# EasyEDA Pro project brainmodule1.epro, schematic Schematic
Board Name: HV No Display; Create Date: 2025-05-05; Page Name: P1; Project Name: HV No Display; Schematic Name: Schematic; Update Date: 2025-05-05; Company: Halo Vision; Drawn: Kahu Hutton; Page Size: A4; Part Number: 001; Reviewed: Kahu Hutton; Version: V0.6
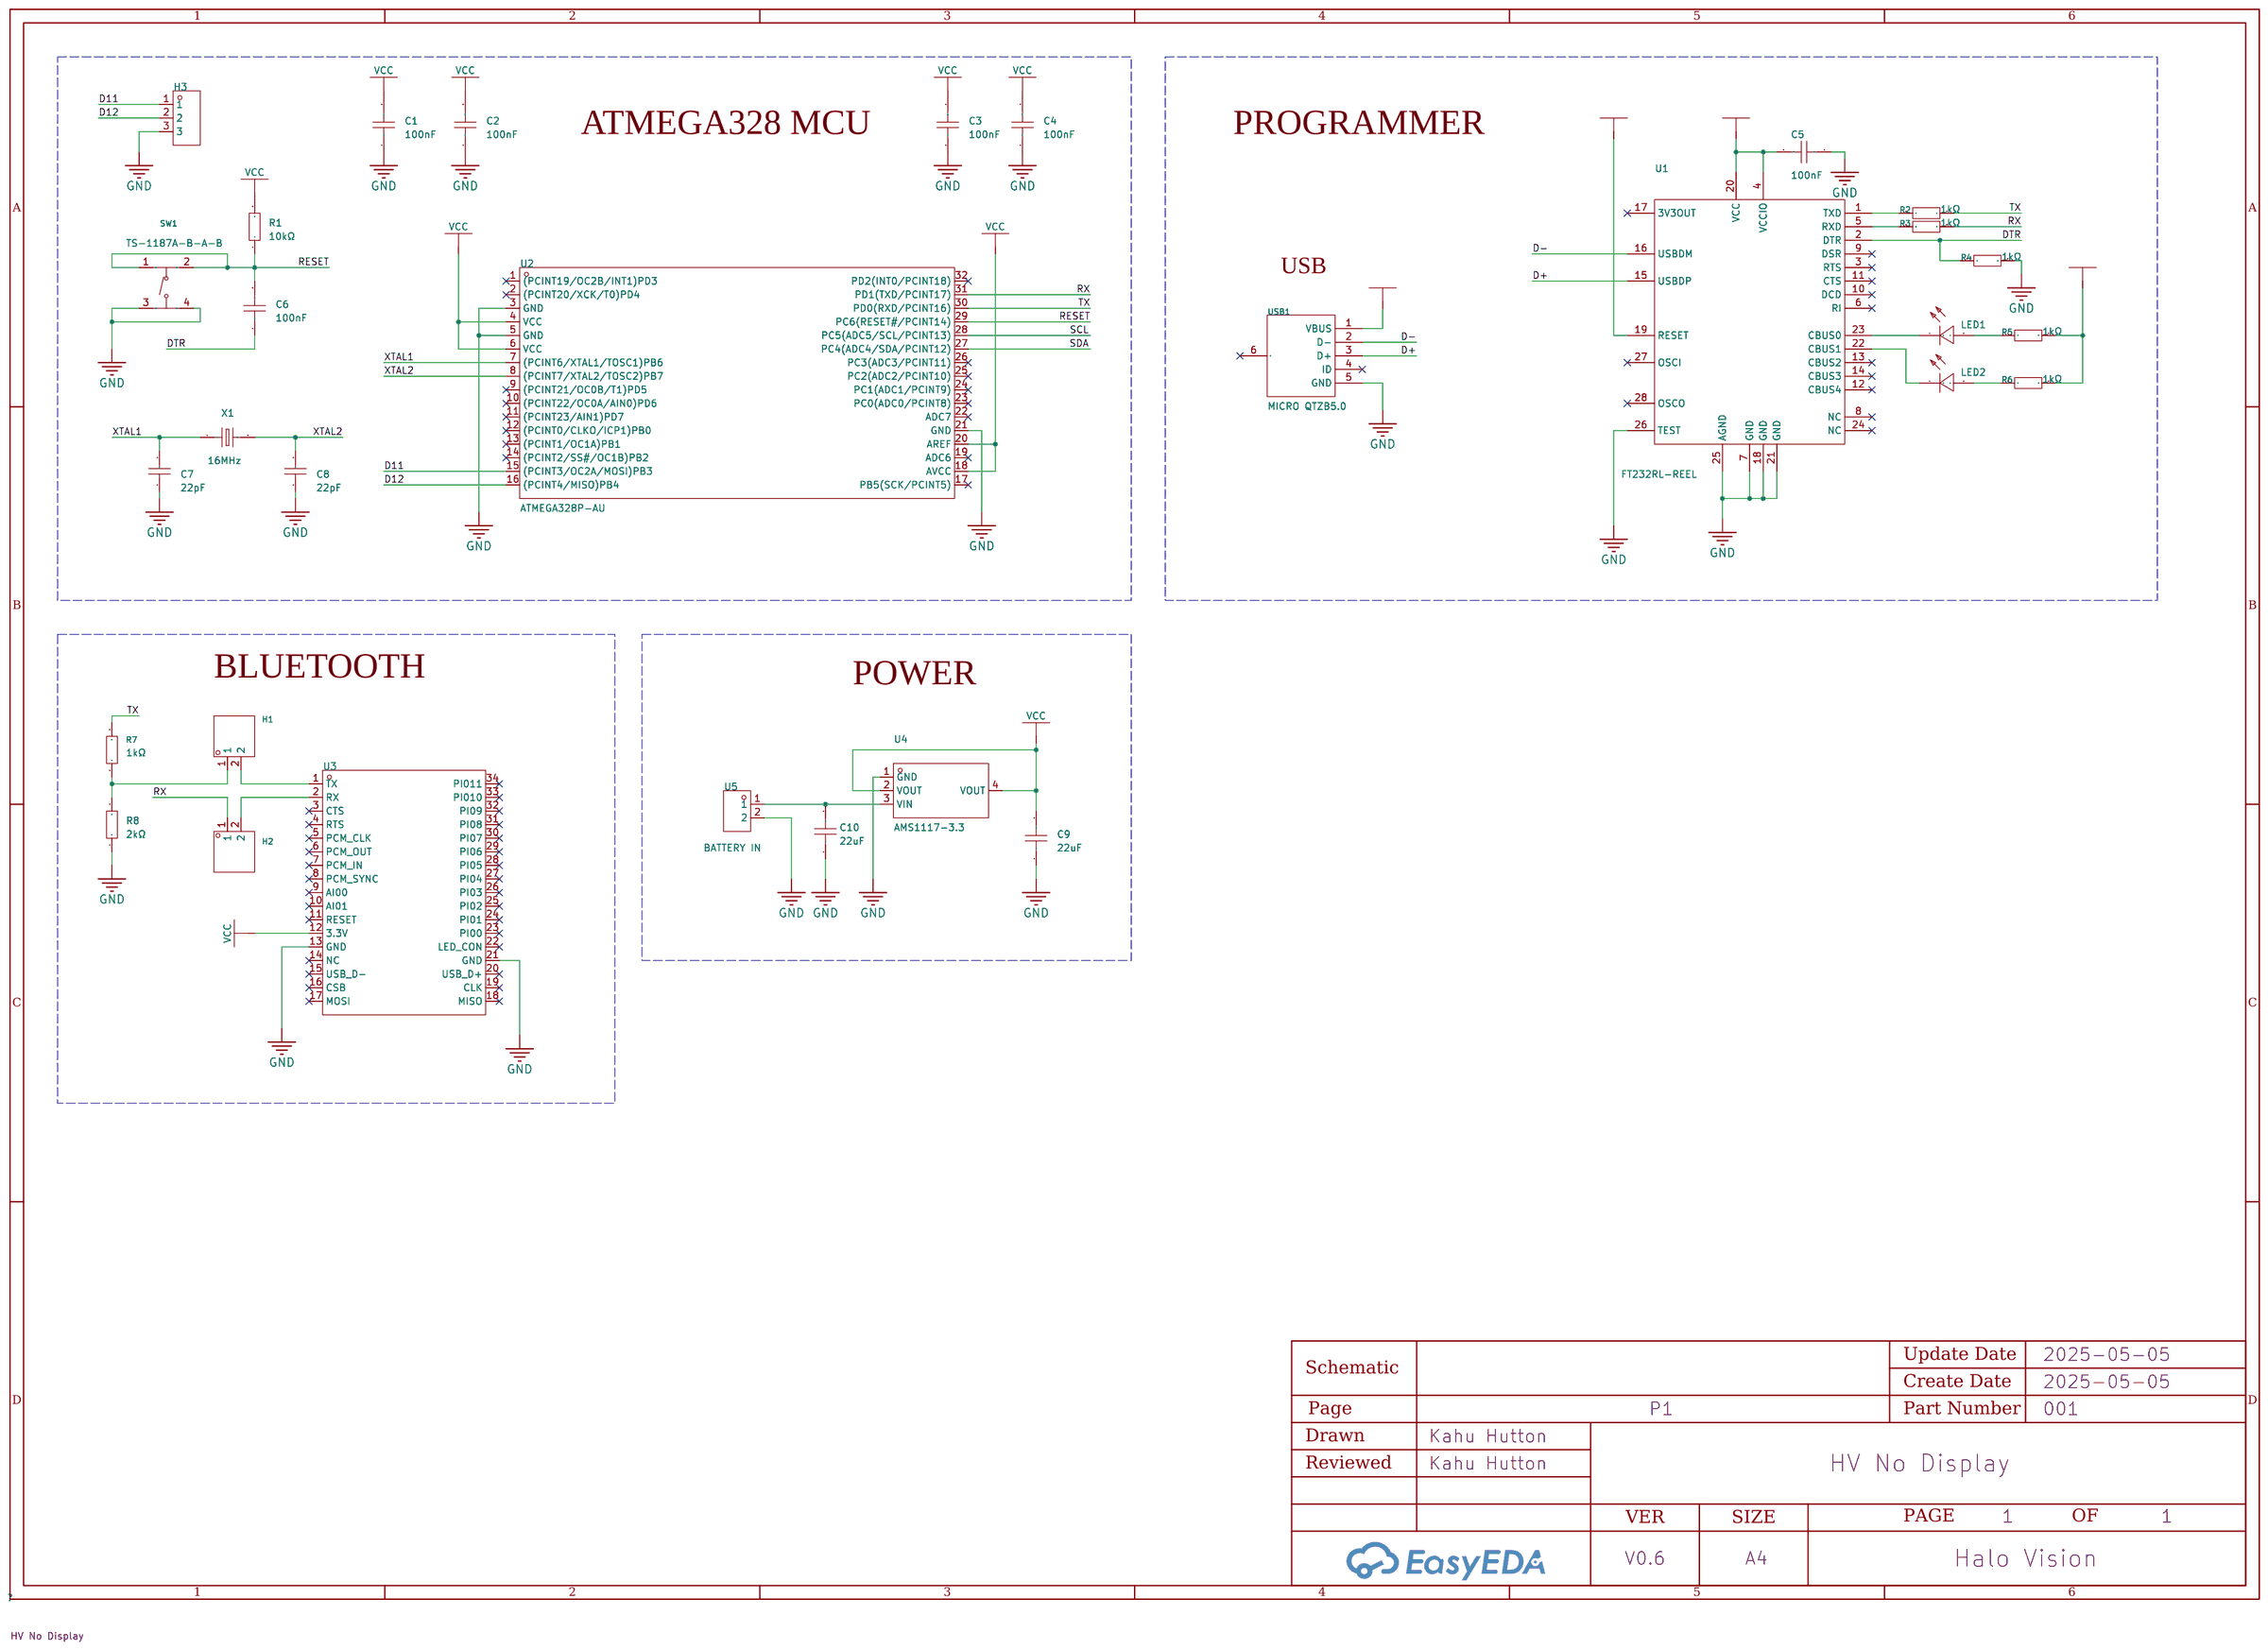
[diagram p0: schematic sheet]

## Parts
C1  100nF  [C0402]
C2  100nF  [C0402]
C3  100nF  [C0402]
C4  100nF  [C0402]
C5  100nF  [C0402]
C6  100nF  [C0402]
C7  22pF  [C0402]
C8  22pF  [C0402]
C9  22uF  [C0805]
C10  22uF  [C0805]
H1  -  [HDR-TH_2P-P2.54-V-M-1]
H2  -  [HDR-TH_2P-P2.54-V-M-1]
H3  -  [HDR-TH_3P-P2.54-V-M]
LED1  TJ-S1005SW4TGLC2R-A5  [LED0402-RD]
LED2  TJ-S1005SW4TGLC2R-A5  [LED0402-RD]
R1  10kΩ  [R0402]
R2  1kΩ  [R0402]
R3  1kΩ  [R0402]
R4  1kΩ  [R0402]
R5  1kΩ  [R0402]
R6  1kΩ  [R0402]
R7  1kΩ  [R0402]
R8  2kΩ  [R0402]
SW1  TS-1187A-B-A-B  [SW-SMD_4P-L5.1-W5.1-P3.70-LS6.5-TL-2]
U1  FT232RL-REEL  [SSOP-28_L10.2-W5.3-P0.65-LS7.8-BL]
U2  ATMEGA328P-AU  [TQFP-32_L7.0-W7.0-P0.80-LS9.0-BL]
U3  -  [BULETM-SMD_HC-05]
U4  AMS1117-3.3  [SOT-223-3_L6.5-W3.4-P2.30-LS7.0-BR]
U5  BATTERY IN  [CONN-TH_2P-P5.08_DB128L-5.08-2P]
USB1  MICRO QTZB5.0  [MICRO-USB-SMD_MICRO-QTZB5.0]
X1  16MHz  [HC-49S_L11.4-W4.8]

## Library data of the parts
C1-C6 = CL05B104KB54PNC: Capacitance: Tolerance:±10% Tolerance:±10% Voltage Rated: Temperature Coefficient:; LCSC Part Name: 100nF ±10% 50V; Supplier Part: C307331; Manufacturer: SAMSUNG(三星); Supplier Footprint: 0402; JLCPCB Part Class: Basic Part; Datasheet: https://atta.szlcsc.com/upload/public/pdf/source/20160218/1457707763339.pdf; Supplier: LCSC; Tolerance: ±10%
C7 C8 = 0402CG220J500NT: Capacitance: Tolerance:±5% Tolerance:±5% Voltage Rated: Temperature Coefficient:; LCSC Part Name: 22pF ±5% 50V; Supplier Part: C1555; Manufacturer: FH(风华); Supplier Footprint: 0402; JLCPCB Part Class: Basic Part; Datasheet: https://atta.szlcsc.com/upload/public/pdf/source/20200305/C486355_26A10D38EF8C2A5C37091D0039909270.pdf; Supplier: LCSC; Tolerance: ±5%
C9 C10 = CL21A226MAQNNNE: Capacitance: Tolerance:±20% Tolerance:±20% Voltage Rated: Temperature Coefficient:; LCSC Part Name: 22uF ±20% 25V; Supplier Part: C45783; Manufacturer: SAMSUNG(三星); Supplier Footprint: 0805; JLCPCB Part Class: Basic Part; Datasheet: https://atta.szlcsc.com/upload/public/pdf/source/20160218/1457707763339.pdf; Supplier: LCSC; Tolerance: ±20%
H1 H2 = HDR-M_2.54_1x2P: Supplier Footprint: Through
H3 = HDR-M_2.54_1x3P: Supplier Footprint: Through
LED1 LED2 = TJ-S1005SW4TGLC2R-A5: Emitted Color:Red; LCSC Part Name: 红灯; Supplier Part: C273598; Manufacturer: TOGIALED(统佳); Supplier Footprint: 0402; JLCPCB Part Class: Extended Part; Datasheet: https://atta.szlcsc.com/upload/public/pdf/source/20180904/C273598_1D07E90CD4668CC0D8ECC89225AAD9B4.pdf; Supplier: LCSC; Emitted Color: Red
R1 = 0402WGF1002TCE: Type:Thick Film Resistors Resistance:10kΩ Tolerance:±1% Tolerance:±1% Power(Watts): Overload Voltage (Max): Temperature Coefficient:±100ppm/℃ Temperature Coefficient:±100ppm/℃ Operating Temperature Range:-55℃~+155℃ Operating Temperature Range:-55℃~+155℃; LCSC Part Name: 10kΩ ±1% 62.5mW 厚膜电阻; Supplier Part: C25744; Manufacturer: UNI-ROYAL(厚声); Supplier Footprint: 0402; JLCPCB Part Class: Basic Part; Datasheet: https://atta.szlcsc.com/upload/public/pdf/source/20200306/C422600_1E6D84923E4A46A82E41ADD87F860B5C.pdf; Supplier: LCSC; Type: Thick Film Resistors; Tolerance: ±1%; Temperature Coefficient: ±100ppm/℃; Operating Temperature Range: -55℃~+155℃
R2-R7 = 0402WGF1001TCE: Type:Thick Film Resistors Resistance:1kΩ Tolerance:±1% Tolerance:±1% Power(Watts): Overload Voltage (Max): Temperature Coefficient:±100ppm/℃ Temperature Coefficient:±100ppm/℃ Operating Temperature Range:-55℃~+155℃ Operating Temperature Range:-55℃~+155℃; LCSC Part Name: 1kΩ ±1% 62.5mW 厚膜电阻; Supplier Part: C11702; Manufacturer: UNI-ROYAL(厚声); Supplier Footprint: 0402; JLCPCB Part Class: Basic Part; Datasheet: https://atta.szlcsc.com/upload/public/pdf/source/20200306/C422600_1E6D84923E4A46A82E41ADD87F860B5C.pdf; Supplier: LCSC; Type: Thick Film Resistors; Tolerance: ±1%; Temperature Coefficient: ±100ppm/℃; Operating Temperature Range: -55℃~+155℃
R8 = 0402WGF2001TCE: Type:Thick Film Resistors Resistance: Tolerance:±1% Tolerance:±1% Power(Watts): Temperature Coefficient:±100ppm/℃ Temperature Coefficient:±100ppm/℃ Overload Voltage (Max): Operating Temperature Range:-55℃~+155℃ Operating Temperature Range:-55℃~+155℃; Supplier: LCSC; Manufacturer: UNI-ROYAL(厚声); Supplier Part: C4109; JLCPCB Part Class: Basic Part; LCSC Part Name: 厚膜电阻 2kΩ ±1% 62.5mW; Supplier Footprint: 0402; Datasheet: https://atta.szlcsc.com/upload/public/pdf/source/20200306/C422600_1E6D84923E4A46A82E41ADD87F860B5C.pdf; Type: Thick Film Resistors; Tolerance: ±1%; Temperature Coefficient: ±100ppm/℃; Operating Temperature Range: -55℃~+155℃
SW1 = TS-1187A-B-A-B: Circuit:SPST Actuator Style:Round Button Operating Force:160gf Mounting Style:Brick nogging Switch Length:5.1mm Switch Width:5.1mm Switch Height:1.5mm Strike Gundam:不带 Contact Current:50mA Voltage Rating (DC):12V Insulation Resistance:- Actuator/Cap Color; LCSC Part Name: 5.1*5.1*1.5mm 立贴 轻触开关; Supplier Part: C318884; Manufacturer: XKB Connectivity(中国星坤); Supplier Footprint: SMD; JLCPCB Part Class: Basic Part; Datasheet: https://atta.szlcsc.com/upload/public/pdf/source/20200227/C318890_053E50208A88A7BA1965D8746000774E.pdf; Supplier: LCSC; Circuit: SPST; Actuator Style: Round Button; Operating Force: 160gf; Mounting Style: Brick nogging; Switch Length: 5.1mm; Switch Width: 5.1mm; Switch Height: 1.5mm; Strike Gundam: 不带; Contact Current: 50mA; Voltage Rating (DC): 12V; Actuator/Cap Color: 金色; With Lamp: No; Mechanical Life: 10万次; Operating Temperature: -30℃~+85℃
U1 = FT232RL-REEL: Applications Function:USB转UART Protocol:UART Supply Voltage:3.3V~5.25V Supply Voltage:3.3V~5.25V Operating Temperature:-40℃~+85℃ Operating Temperature:-40℃~+85℃; LCSC Part Name: USB UART IC; Supplier Part: C8690; Manufacturer: FTDI(飞特帝亚); Supplier Footprint: SSOP-28-208mil; JLCPCB Part Class: Extended Part; Datasheet: https://atta.szlcsc.com/upload/public/pdf/source/20130221/1457706592200.pdf; Supplier: LCSC; Applications Function: USB转UART; Protocol: UART; Supply Voltage: 3.3V~5.25V; Operating Temperature: -40℃~+85℃
U2 = ATMEGA328P-AU_C14877: CPU Core:AVR Program Storage Size:32KB RAM Size:2KB GPIO Ports Number:23 Operating Voltage Range:1.8V~5.5V Operating Voltage Range:1.8V~5.5V CPU Maximum Speed:20MHz Program Memory Type:FLASH EEPROM:1KB Operating Temperature Range:-40℃~+85℃ Operating Tempe; LCSC Part Name: 基于AVR增强型RISC架构的低功耗CMOS 8位微控制器; Supplier Part: C14877; Manufacturer: MICROCHIP(美国微芯); Supplier Footprint: TQFP-32(7x7); JLCPCB Part Class: Extended Part; Datasheet: https://atta.szlcsc.com/upload/public/pdf/source/20140621/1457707095197.pdf; Supplier: LCSC; CPU Core: AVR; Program Storage Size: 32KB; RAM Size: 2KB; GPIO Ports Number: 23; Operating Voltage Range: 1.8V~5.5V; CPU Maximum Speed: 20MHz; Program Memory Type: FLASH; EEPROM: 1KB; Operating Temperature Range: -40℃~+85℃; ADC (Bit): 10bit; Peripheral/Function: WDT；PWM；WDT；PWM; Watchdog: 有; Low-Voltage Detect: 有; Internal Oscillator: 有
U3 = HC-05: Supplier Part: C9900001063; Supplier Footprint: SMD-34_13.0X27.0X1.50P; JLCPCB Part Class: 扩展库; Datasheet: 2021-10-26/262798S/0744a6e575994a8186035cee355055ea/HC-05.pdf; Supplier: LCSC
U4 = AMS1117-3.3_C6186: Output Type: Maximum Input Voltage:- Output Voltage:3.3V Output Voltage:3.3V MAX Output Current:1A Power Supply Rejection Ratio (PSRR):72dB@(120Hz) Dropout Voltage:1.3V@(800mA) standby current:- Noise:- Feature:- Operating Temperature:- Operating Temperat; LCSC Part Name: 输出3.3V 1A; Supplier Part: C6186; Manufacturer: AMS; Supplier Footprint: SOT-223; JLCPCB Part Class: Basic Part; Datasheet: https://atta.szlcsc.com/upload/public/pdf/source/20180727/C6186_7A095716F0823C02F1997A905E26C086.pdf; Supplier: LCSC; Output Voltage: 3.3V; MAX Output Current: 1A; Power Supply Rejection Ratio (PSRR): 72dB@(120Hz); Dropout Voltage: 1.3V@(800mA); Output Polarity: Positive electrode; Number of Outputs: 1
U5 = DB128L-5.08-2P-GN-S: Structure:1x2P Pitch:5.08mm Color:Green Mounting Style:Straight Current Rating (Max):18A Voltage Rating (Max):250V Number of Pins:2P Number of Rows:1 Wire Gauge - AWG:12~30 Wire Gauge - AWG:12~30 Wire Gauge - mm2:2.5 Wire Gauge - mm2:2.5 Number of PINs Pe; LCSC Part Name: 5.08mm 1x2P 排数:1 每排P数:2 直插; Supplier Part: C395868; Manufacturer: DORABO(地博电气); Supplier Footprint: 插件,P=5.08mm; JLCPCB Part Class: Extended Part; Datasheet: https://atta.szlcsc.com/upload/public/pdf/source/20230106/B067FE0E641A396A370D47F93C345689.pdf; Supplier: LCSC; Structure: 1x2P; Pitch: 5.08mm; Color: Green; Mounting Style: Straight; Current Rating (Max): 18A; Voltage Rating (Max): 250V; Number of Pins: 2P; Number of Rows: 1; Wire Gauge - AWG: 12~30; Wire Gauge - mm2: 2.5; Number of PINs Per Row: 2; Operating Temperature Range: -40℃~+105℃
USB1 = MICRO QTZB5.0: Connector Type:Micro-B Standard:USB 2.0 Gender:Female Number of Ports:1 Number of Contacts:5P Mounting Style:卧贴 Current Rating - Power (Max):1A Operating Temperature Range:-30℃~+80℃ Operating Temperature Range:-30℃~+80℃; LCSC Part Name: Micro-B 母 卧贴; Supplier Part: C2681556; Manufacturer: SHOU HAN(首韩); Supplier Footprint: SMD; JLCPCB Part Class: Extended Part; Datasheet: https://atta.szlcsc.com/upload/public/pdf/source/20210107/C2681556_CFA58CC35A80C3AC7F409A47931A5E57.pdf; Supplier: LCSC; Connector Type: Micro-B; Standard: USB 2.0; Gender: Female; Number of Ports: 1; Number of Contacts: 5P; Mounting Style: 卧贴; Current Rating - Power (Max): 1A; Operating Temperature Range: -30℃~+80℃
X1 = TAXM16M2GLFBET2T: Crystal Type:贴片晶振 Frequency: Normal temperature Frequency Tolerance:±30ppm Normal temperature Frequency Tolerance:±30ppm External load capacitor: Frequency Stability(Full temperature range):±30ppm Frequency Stability(Full temperature range):±30ppm Equival; LCSC Part Name: 16MHz ±30ppm 20pF; Supplier Part: C111377; Manufacturer: YJX(雅晶鑫); Supplier Footprint: HC-49S-SMD; JLCPCB Part Class: Extended Part; Datasheet: https://atta.szlcsc.com/upload/public/pdf/source/20190305/C362352_AFD953984E9CF948957766F91AB56AA4.pdf; Supplier: LCSC; Crystal Type: 贴片晶振; Normal temperature Frequency Tolerance: ±30ppm; Frequency Stability(Full temperature range): ±30ppm; Equivalent Series Resistance (ESR): 50Ω

## Nets
GND: C1.1 C2.1 C3.1 C4.1 C5.1 C7.1 C8.1 C9.1 C10.1 H3.3 R4.2 R8.1 SW1.3(C) SW1.4(D) U1.7(GND) U1.18(GND) U1.21(GND) U1.25(AGND) U1.26(TEST) U2.3(GND) U2.5(GND) U2.21(GND) U3.13(GND) U3.21(GND) U4.1(GND) U5.2 USB1.5(GND)
VBUS: C5.2 R5.2 R6.2 U1.4(VCCIO) U1.19(RESET) U1.20(VCC) USB1.1(VBUS)
VCC: C1.2 C2.2 C3.2 C4.2 C9.2 R1.2 U2.4(VCC) U2.6(VCC) U2.18(AVCC) U2.20(AREF) U3.12(3.3V) U4.2(VOUT) U4.4(VOUT)
D11: H3.1 U2.15((PCINT3/OC2A/MOSI)PB3)
D12: H3.2 U2.16((PCINT4/MISO)PB4)
D+: U1.15(USBDP) USB1.3(D+)
D-: U1.16(USBDM) USB1.2(D-)
DTR: C6.1 R4.1 U1.2(DTR)
RESET: C6.2 R1.1 SW1.1(A) SW1.2(B) U2.29(PC6(RESET#/PCINT14))
RX: H2.1 R3.2 U2.31(PD1(TXD/PCINT17))
SCL: U2.28(PC5(ADC5/SCL/PCINT13))
SDA: U2.27(PC4(ADC4/SDA/PCINT12))
TX: R2.2 R7.2 U2.30(PD0(RXD/PCINT16))
XTAL1: C7.2 U2.7((PCINT6/XTAL1/TOSC1)PB6) X1.1
XTAL2: C8.2 U2.8((PCINT7/XTAL2/TOSC2)PB7) X1.2
$1N2642: R2.1 U1.1(TXD)
$1N2643: R3.1 U1.5(RXD)
$1N2655: LED1.1(C) U1.23(CBUS0)
$1N2656: LED2.1(C) U1.22(CBUS1)
$1N2657: LED1.2(A) R5.1
$1N2658: LED2.2(A) R6.1
$1N2690: H1.2 U3.1(TX)
$1N2691: H2.2 U3.2(RX)
$1N2692: H1.1 R7.1 R8.2
$1N3876: C10.2 U4.3(VIN) U5.1

Not connected (* = marked no-connect by the designer): U1 3(RTS)* 6(RI)* 8(NC)* 9(DSR)* 10(DCD)* 11(CTS)* 12(CBUS4)* 13(CBUS2)* 14(CBUS3)* 17(3V3OUT)* 24(NC)* 27(OSCI)* 28(OSCO)*; U2 1((PCINT19/OC2B/INT1)PD3)* 2((PCINT20/XCK/T0)PD4)* 9((PCINT21/OC0B/T1)PD5)* 10((PCINT22/OC0A/AIN0)PD6)* 11((PCINT23/AIN1)PD7)* 12((PCINT0/CLKO/ICP1)PB0)* 13((PCINT1/OC1A)PB1)* 14((PCINT2/SS#/OC1B)PB2)* 17(PB5(SCK/PCINT5))* 19(ADC6)* 22(ADC7)* 23(PC0(ADC0/PCINT8))* 24(PC1(ADC1/PCINT9))* 25(PC2(ADC2/PCINT10))* 26(PC3(ADC3/PCINT11))* 32(PD2(INT0/PCINT18))*; U3 3(CTS)* 4(RTS)* 5(PCM_CLK)* 6(PCM_OUT)* 7(PCM_IN)* 8(PCM_SYNC)* 9(AI00)* 10(AI01)* 11(RESET)* 14(NC)* 15(USB_D-)* 16(CSB)* 17(MOSI)* 18(MISO)* 19(CLK)* 20(USB_D+)* 22(LED_CON)* 23(PI00)* 24(PI01)* 25(PI02)* 26(PI03)* 27(PI04)* 28(PI05)* 29(PI06)* 30(PI07)* 31(PI08)* 32(PI09)* 33(PI010)* 34(PI011)*; USB1 4(ID)* 6(EH)*

## Notes on the sheet
- ATMEGA328 MCU
- PROGRAMMER
- USB
- BLUETOOTH
- POWER
